# Altium schematic sheet STM32H743.SchDoc
size A4; SheetNumber: 2; SheetTotal: 3
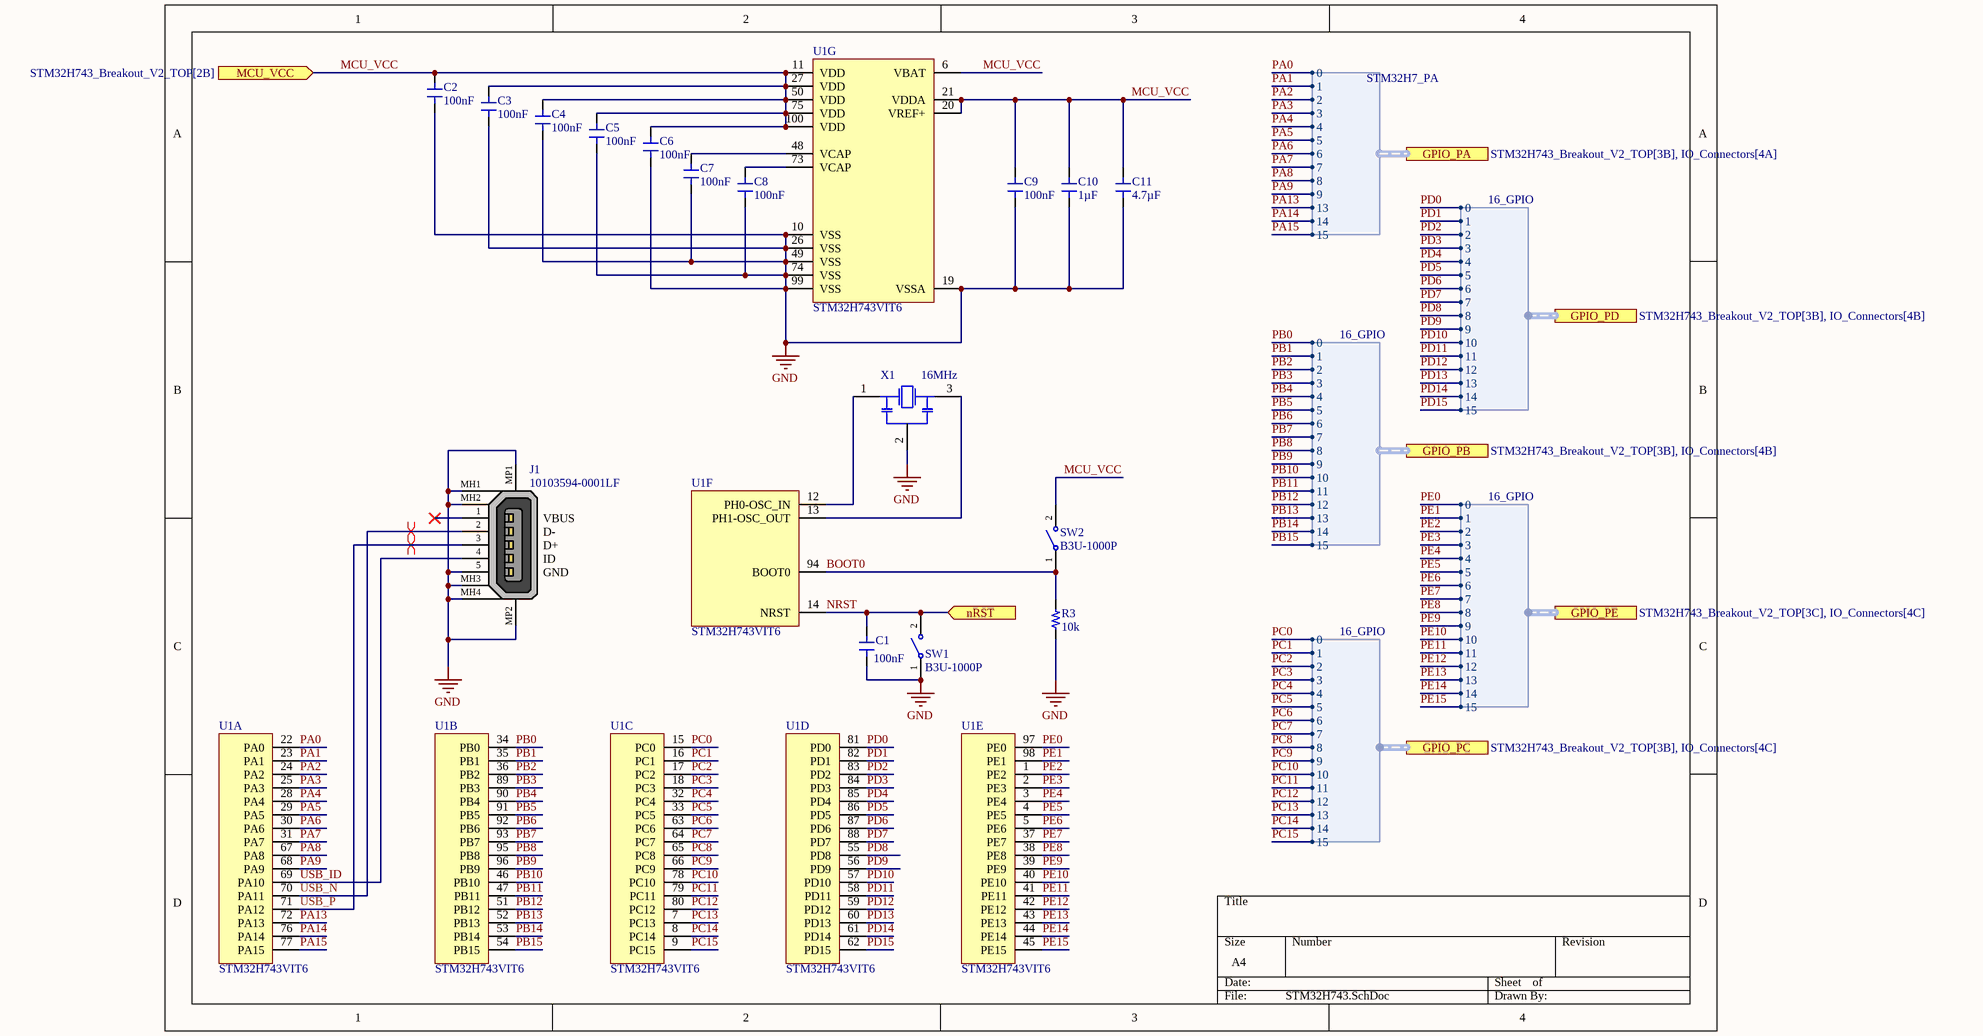
[diagram p0: STM32H743.SchDoc]

## Parts
C1  Capacitance: 100nF  [C-0603]  (hidden comment: C 0603 100nF 10% 50V X7R)
C2  Capacitance: 100nF  [C-0603]  (hidden comment: C 0603 100nF 10% 50V X7R)
C3  Capacitance: 100nF  [C-0603]  (hidden comment: C 0603 100nF 10% 50V X7R)
C4  Capacitance: 100nF  [C-0603]  (hidden comment: C 0603 100nF 10% 50V X7R)
C5  Capacitance: 100nF  [C-0603]  (hidden comment: C 0603 100nF 10% 50V X7R)
C6  Capacitance: 100nF  [C-0603]  (hidden comment: C 0603 100nF 10% 50V X7R)
C7  Capacitance: 100nF  [C-0603]  (hidden comment: C 0603 100nF 10% 50V X7R)
C8  Capacitance: 100nF  [C-0603]  (hidden comment: C 0603 100nF 10% 50V X7R)
C9  Capacitance: 100nF  [C-0603]  (hidden comment: C 0603 100nF 10% 50V X7R)
C10  Capacitance: 1µF  [C-0603]  (hidden comment: C 0603 1µF 10% 50V X5R)
C11  Capacitance: 4.7µF  [C-0603]  (hidden comment: C 0603 4.7µF 10% 16V X5R)
J1  10103594-0001LF  [10103594-0001LF]
R3  Resistance: 10k  [R-0603]  (hidden comment: R 0603 10k 1% 0.100W 100PPM)
SW1  B3U-1000P  [B3U-1000P]
SW2  B3U-1000P  [B3U-1000P]
U1  STM32H743VIT6  [STM LQFP-100]  (parts A,B,C,D,E,F,G of 7)
X1  Frequency: 16MHz  [MURATA_CSTNE16M0V53C000R0-Footprint-1]  (hidden comment: MURATA_CSTNE16M0V53C000R0)

## Ports
GPIO_PA (harness STM32H7_PA, see STM32H743_Breakout_V2_TOP[3B], IO_Connectors[4A]), GPIO_PB (harness 16_GPIO, see STM32H743_Breakout_V2_TOP[3B], IO_Connectors[4B]), GPIO_PC (harness 16_GPIO, see STM32H743_Breakout_V2_TOP[3B], IO_Connectors[4C]), GPIO_PD (harness 16_GPIO, see STM32H743_Breakout_V2_TOP[3B], IO_Connectors[4B]), GPIO_PE (harness 16_GPIO, see STM32H743_Breakout_V2_TOP[3C], IO_Connectors[4C]), MCU_VCC (in, see STM32H743_Breakout_V2_TOP[2B]), nRST (in)

## Harnesses
STM32H7_PA: 0, 1, 2, 3, 4, 5, 6, 7, 8, 9, 13, 14, 15
16_GPIO: 0, 1, 2, 3, 4, 5, 6, 7, 8, 9, 10, 11, 12, 13, 14, 15

## Nets
GND: C1.1 C2.1 C3.1 C4.1 C5.1 C6.1 C7.1 C8.1 C9.1 C10.1 C11.1 J1.5(GND) J1.MH1 J1.MH2 J1.MH3 J1.MH4 J1.MP1 J1.MP2 R3.1 SW1.1 U1.10(VSS) U1.19(VSSA) U1.26(VSS) U1.49(VSS) U1.74(VSS) U1.99(VSS) X1.2(GND)
BOOT0: R3.2 SW2.1 U1.94(BOOT0)
MCU_VCC: C2.2 C3.2 C4.2 C5.2 C6.2 C9.2 C10.2 C11.2 SW2.2 U1.6(VBAT) U1.11(VDD) U1.20(VREF+) U1.21(VDDA) U1.27(VDD) U1.50(VDD) U1.75(VDD) U1.100(VDD) ; port MCU_VCC
NRST: C1.2 SW1.2 U1.14(NRST) ; port nRST
PA0: U1.22(PA0) ; port GPIO_PA.0
PA1: U1.23(PA1) ; port GPIO_PA.1
PA2: U1.24(PA2) ; port GPIO_PA.2
PA3: U1.25(PA3) ; port GPIO_PA.3
PA4: U1.28(PA4) ; port GPIO_PA.4
PA5: U1.29(PA5) ; port GPIO_PA.5
PA6: U1.30(PA6) ; port GPIO_PA.6
PA7: U1.31(PA7) ; port GPIO_PA.7
PA8: U1.67(PA8) ; port GPIO_PA.8
PA9: U1.68(PA9) ; port GPIO_PA.9
PA13: U1.72(PA13) ; port GPIO_PA.13
PA14: U1.76(PA14) ; port GPIO_PA.14
PA15: U1.77(PA15) ; port GPIO_PA.15
PB0: U1.34(PB0) ; port GPIO_PB.0
PB1: U1.35(PB1) ; port GPIO_PB.1
PB2: U1.36(PB2) ; port GPIO_PB.2
PB3: U1.89(PB3) ; port GPIO_PB.3
PB4: U1.90(PB4) ; port GPIO_PB.4
PB5: U1.91(PB5) ; port GPIO_PB.5
PB6: U1.92(PB6) ; port GPIO_PB.6
PB7: U1.93(PB7) ; port GPIO_PB.7
PB8: U1.95(PB8) ; port GPIO_PB.8
PB9: U1.96(PB9) ; port GPIO_PB.9
PB10: U1.46(PB10) ; port GPIO_PB.10
PB11: U1.47(PB11) ; port GPIO_PB.11
PB12: U1.51(PB12) ; port GPIO_PB.12
PB13: U1.52(PB13) ; port GPIO_PB.13
PB14: U1.53(PB14) ; port GPIO_PB.14
PB15: U1.54(PB15) ; port GPIO_PB.15
PC0: U1.15(PC0) ; port GPIO_PC.0
PC1: U1.16(PC1) ; port GPIO_PC.1
PC2: U1.17(PC2) ; port GPIO_PC.2
PC3: U1.18(PC3) ; port GPIO_PC.3
PC4: U1.32(PC4) ; port GPIO_PC.4
PC5: U1.33(PC5) ; port GPIO_PC.5
PC6: U1.63(PC6) ; port GPIO_PC.6
PC7: U1.64(PC7) ; port GPIO_PC.7
PC8: U1.65(PC8) ; port GPIO_PC.8
PC9: U1.66(PC9) ; port GPIO_PC.9
PC10: U1.78(PC10) ; port GPIO_PC.10
PC11: U1.79(PC11) ; port GPIO_PC.11
PC12: U1.80(PC12) ; port GPIO_PC.12
PC13: U1.7(PC13) ; port GPIO_PC.13
PC14: U1.8(PC14) ; port GPIO_PC.14
PC15: U1.9(PC15) ; port GPIO_PC.15
PD0: U1.81(PD0) ; port GPIO_PD.0
PD1: U1.82(PD1) ; port GPIO_PD.1
PD2: U1.83(PD2) ; port GPIO_PD.2
PD3: U1.84(PD3) ; port GPIO_PD.3
PD4: U1.85(PD4) ; port GPIO_PD.4
PD5: U1.86(PD5) ; port GPIO_PD.5
PD6: U1.87(PD6) ; port GPIO_PD.6
PD7: U1.88(PD7) ; port GPIO_PD.7
PD8: U1.55(PD8) ; port GPIO_PD.8
PD9: U1.56(PD9) ; port GPIO_PD.9
PD10: U1.57(PD10) ; port GPIO_PD.10
PD11: U1.58(PD11) ; port GPIO_PD.11
PD12: U1.59(PD12) ; port GPIO_PD.12
PD13: U1.60(PD13) ; port GPIO_PD.13
PD14: U1.61(PD14) ; port GPIO_PD.14
PD15: U1.62(PD15) ; port GPIO_PD.15
PE0: U1.97(PE0) ; port GPIO_PE.0
PE1: U1.98(PE1) ; port GPIO_PE.1
PE2: U1.1(PE2) ; port GPIO_PE.2
PE3: U1.2(PE3) ; port GPIO_PE.3
PE4: U1.3(PE4) ; port GPIO_PE.4
PE5: U1.4(PE5) ; port GPIO_PE.5
PE6: U1.5(PE6) ; port GPIO_PE.6
PE7: U1.37(PE7) ; port GPIO_PE.7
PE8: U1.38(PE8) ; port GPIO_PE.8
PE9: U1.39(PE9) ; port GPIO_PE.9
PE10: U1.40(PE10) ; port GPIO_PE.10
PE11: U1.41(PE11) ; port GPIO_PE.11
PE12: U1.42(PE12) ; port GPIO_PE.12
PE13: U1.43(PE13) ; port GPIO_PE.13
PE14: U1.44(PE14) ; port GPIO_PE.14
PE15: U1.45(PE15) ; port GPIO_PE.15
USB_ID: J1.4(ID) U1.69(PA10)
USB_N: J1.2(D-) U1.70(PA11)
USB_P: J1.3(D+) U1.71(PA12)
NetC7_2: C7.2 U1.48(VCAP)
NetC8_2: C8.2 U1.73(VCAP)
NetU1_12: U1.12(PH0-OSC_IN) X1.1(A)
NetU1_13: U1.13(PH1-OSC_OUT) X1.3(B)

Not connected (* = marked no-connect by the designer): J1 1(VBUS)*

## Layout directives
differential pair: USB_N, USB_P

## Library data of the parts
C1-C9 = CMP-00008-4: SMD Capacitor, Ceramic; Voltage: 50V; Tolerance: 10%; Dielectric: X7R; Case/Package: 0603; Dielectric Material: Ceramic; RoHS: Yes; Min Operating Temperature: -55°C; Max Operating Temperature: 125°C; LCSC P/N: C14663
C10 = CMP-00039-2: SMD Capacitor, Ceramic; Voltage: 50V; Tolerance: 10%; Dielectric: X5R; Case/Package: 0603; Max Operating Temperature: 85°C; Min Operating Temperature: -55°C; Dielectric Material: Ceramic; LCSC P/N: C15849; RoHS: Yes
C11 = CMP-00010-4: SMD Capacitor, Ceramic; Voltage: 16V; Tolerance: 10%; Dielectric: X5R; Case/Package: 0603; LCSC P/N: C19666; Dielectric Material: Ceramic; Min Operating Temperature: -55°C; Max Operating Temperature: 85°C; RoHS: Yes
J1 = CMP-00017-5: USB 2.0 Micro-B, 5 leads, Through-Hole, Right Angle; Connector Type: Receptacle; Voltage Rating (AC): 100V; Number of Contacts: 5; Current Rating Per Contact: 1.8A; RoHS: Yes; Max Operating Temperature: 80°C; Min Operating Temperature: -30°C; Orientation: Right Angle; Mount: Through-Hole
R3 = CMP-00021-6: SMD Resistor, Thick Film; Power Rating: 100mW; Voltage Rating: 75V; Tolerance: 1%; Case/Package: 0603; Min Operating Temperature: -55°C; Max Operating Temperature: 155°C; LCSC P/N: C25804; RoHS: Yes; Composition: Thick Film; Temperature Coefficient: 100ppm
SW1 SW2 = CMP-00117-2: Tactile Switch, SPST-NO, 0.05A @ 12VDC, SMD; Voltage Rating (AC): 250V; Voltage Rating (DC): 12V; Max Operating Temperature: 70°C; Min Operating Temperature: -25°C; Digikey P/N: SW1020CT-ND; Mount: SMD; Pins: 2; LCSC P/N: C231329; Case/Package: SMD; RoHS: Yes
U1 = CMP-00101-4: MCU 32-bit ARM Cortex M7 2MB Flash 3.3V 100-Pin LQFP
X1 = CMP-00120-1: Ceramic Resonator 16MHz 15pF SMD; Impedance: 40; Capacitance: 15p; LCSC P/N: C882606; Pins: 3; Digikey P/N: 490-17949-1-ND